# Altium schematic sheet Schematic_WMR.SchDoc
size A; SheetNumber: 1; SheetTotal: 1
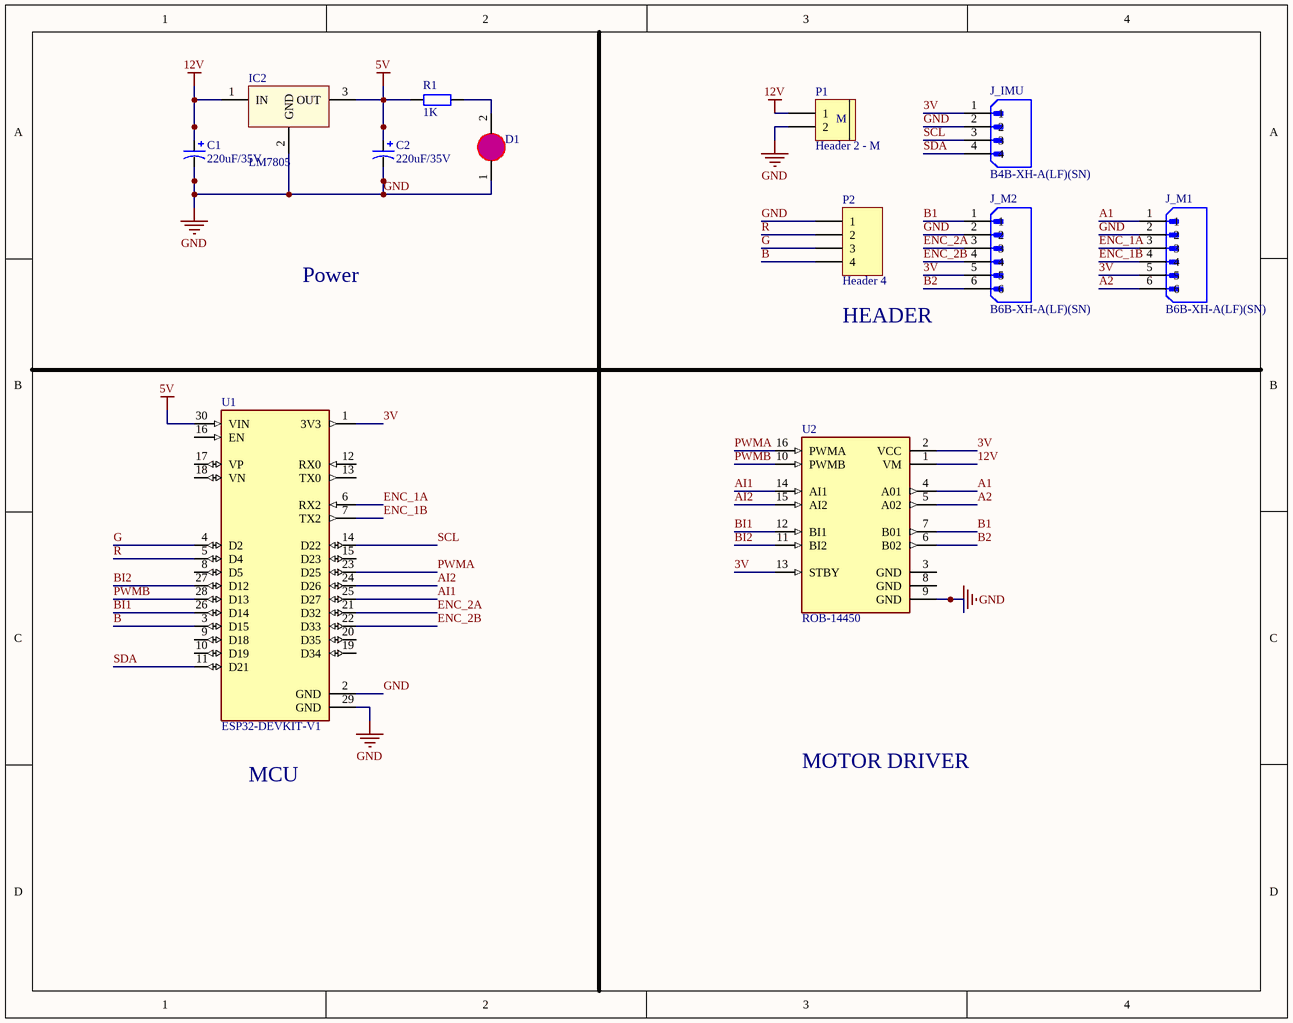
[diagram p0: Schematic_WMR.SchDoc]

## Parts
C1  220uF/35V  [CAP_ALUM_SMD_80102_TYPE_F]
C2  220uF/35V  [CAP_ALUM_SMD_80102_TYPE_F]
D1  LED3  [LED0805]  (value not drawn)
IC2  LM7805  [QTO-220]
J_IMU  B4B-XH-A(LF)(SN)  [JST_B4B-XH-A(LF)(SN)]
J_M1  B6B-XH-A(LF)(SN)  [JST_B6B-XH-A(LF)(SN)]
J_M2  B6B-XH-A(LF)(SN)  [JST_B6B-XH-A(LF)(SN)]
P1  Header 2 - M  [Medium - Header 2]
P2  Header 4  [HDR1X4]
R1  1K  [SM-0805]
U1  ESP32-DEVKIT-V1  [MODULE_ESP32_DEVKIT_V1]
U2  ROB-14450  [MODULE_ROB-14450]

## Nets
5V: C2.1 IC2.3(OUT) R1.1 U1.30(VIN)
12V: C1.1 IC2.1(IN) P1.1 U2.1(VM)
GND: C1.2 C2.2 D1.1(A) IC2.2(GND) J_IMU.2 J_M1.2 J_M2.2 P1.2 P2.1 U1.2(GND) U1.29(GND) U2.9(GND)
3V: J_IMU.1 J_M1.5 J_M2.5 U1.1(3V3) U2.2(VCC) U2.13(STBY)
A1: J_M1.1 U2.4(A01)
A2: J_M1.6 U2.5(A02)
AI1: U1.25(D27) U2.14(AI1)
AI2: U1.24(D26) U2.15(AI2)
B: P2.4 U1.3(D15)
B1: J_M2.1 U2.7(B01)
B2: J_M2.6 U2.6(B02)
BI1: U1.26(D14) U2.12(BI1)
BI2: U1.27(D12) U2.11(BI2)
ENC_1A: J_M1.3 U1.6(RX2)
ENC_1B: J_M1.4 U1.7(TX2)
ENC_2A: J_M2.3 U1.21(D32)
ENC_2B: J_M2.4 U1.22(D33)
G: P2.3 U1.4(D2)
PWMA: U1.23(D25) U2.16(PWMA)
PWMB: U1.28(D13) U2.10(PWMB)
R: P2.2 U1.5(D4)
SCL: J_IMU.3 U1.14(D22)
SDA: J_IMU.4 U1.11(D21)
NetD1_2: D1.2(K) R1.2

Not connected (* = marked no-connect by the designer): U1 8(D5) 9(D18) 10(D19) 12(RX0) 13(TX0) 15(D23) 16(EN) 17(VP) 18(VN) 19(D34) 20(D35); U2 3(GND) 8(GND)

## Notes on the sheet
- Power
- (near P2) HEADER
- MOTOR DRIVER
- MCU
- (in symbol Header 2 - M) M

## Library data of the parts
C1 C2 = EEE-FK1V221P: CAP ALUM 220uF 20% 35V SMD; MFR: Panasonic; Solder: SMT; Value: 220uF/35V; MPN: EEE-FK1V221P; Category: CAPACITOR; PinCount: 2
D1 = LED0805: LED SMD 0805
IC2 = LM78xx: On ap +, from + 5 to + 24VDC; Value: LM7805
J_IMU = B4B-XH-A(LF)(SN): Connector Header Through Hole 4 position 0.098 (2.50mm); MF: JST Sales; SnapEDA_Link: https://www.snapeda.com/parts/B4B-XH-A(LF)(SN)/JST+Sales+America+Inc./view-part/?ref=snap; Package: None; MP: B4B-XH-A(LF)(SN); Check_prices: https://www.snapeda.com/parts/B4B-XH-A(LF)(SN)/JST+Sales+America+Inc./view-part/?ref=eda; Purchase-URL: https://pricing.snapeda.com/search/part/B4B-XH-A(LF)(SN)/?ref=eda; Price: None; Value: *; Availability: In Stock
J_M1 J_M2 = B6B-XH-A(LF)(SN): Connector Header Through Hole 6 position 0.098 (2.50mm); MF: JST Sales; MP: B6B-XH-A(LF)(SN); SnapEDA_Link: https://www.snapeda.com/parts/B6B-XH-A(LF)(SN)/JST+Sales+America+Inc./view-part/?ref=snap; Price: None; Check_prices: https://www.snapeda.com/parts/B6B-XH-A(LF)(SN)/JST+Sales+America+Inc./view-part/?ref=eda; Availability: In Stock; Package: None; Purchase-URL: https://pricing.snapeda.com/search/part/B6B-XH-A(LF)(SN)/?ref=eda; Value: *
P1 = Header 2 - M: Header, 2-Pin, Medium; LatestRevisionDate: 17-Jul-2002; LatestRevisionNote: Re-released for DXP Platform.; Publisher: Altium Limited
P2 = Header 4: Header, 4-Pin; LatestRevisionDate: 17-Jul-2002; LatestRevisionNote: Re-released for DXP Platform.; Publisher: Altium Limited
R1 = RM: Resistor SMD; Value: 1K
U1 = ESP32-DEVKIT-V1: Dual core, Wi-Fi: 2.4 GHz up to 150 Mbits/s,BLE (Bluetooth Low Energy) and legacy Bluetooth, 32 bits, Up to 240 MHz; MF: Do it; Price: None; Availability: Not in stock; Package: None; MP: ESP32-DEVKIT-V1; Value: *; SnapEDA_Link: https://www.snapeda.com/parts/ESP32-DEVKIT-V1/Do+it/view-part/?ref=snap; Check_prices: https://www.snapeda.com/parts/ESP32-DEVKIT-V1/Do+it/view-part/?ref=eda
U2 = ROB-14450: TB6612FNG Motor Controller/Driver Power Management Evaluation Board; MF: SparkFun Electronics; Check_prices: https://www.snapeda.com/parts/ROB-14450/SparkFun%20Electronics/view-part/2656367/?ref=eda; Package: None; MP: ROB-14450; Value: *; Availability: In Stock; SnapEDA_Link: https://www.snapeda.com/parts/ROB-14450/SparkFun%20Electronics/view-part/2656367/?ref=snap; Price: None